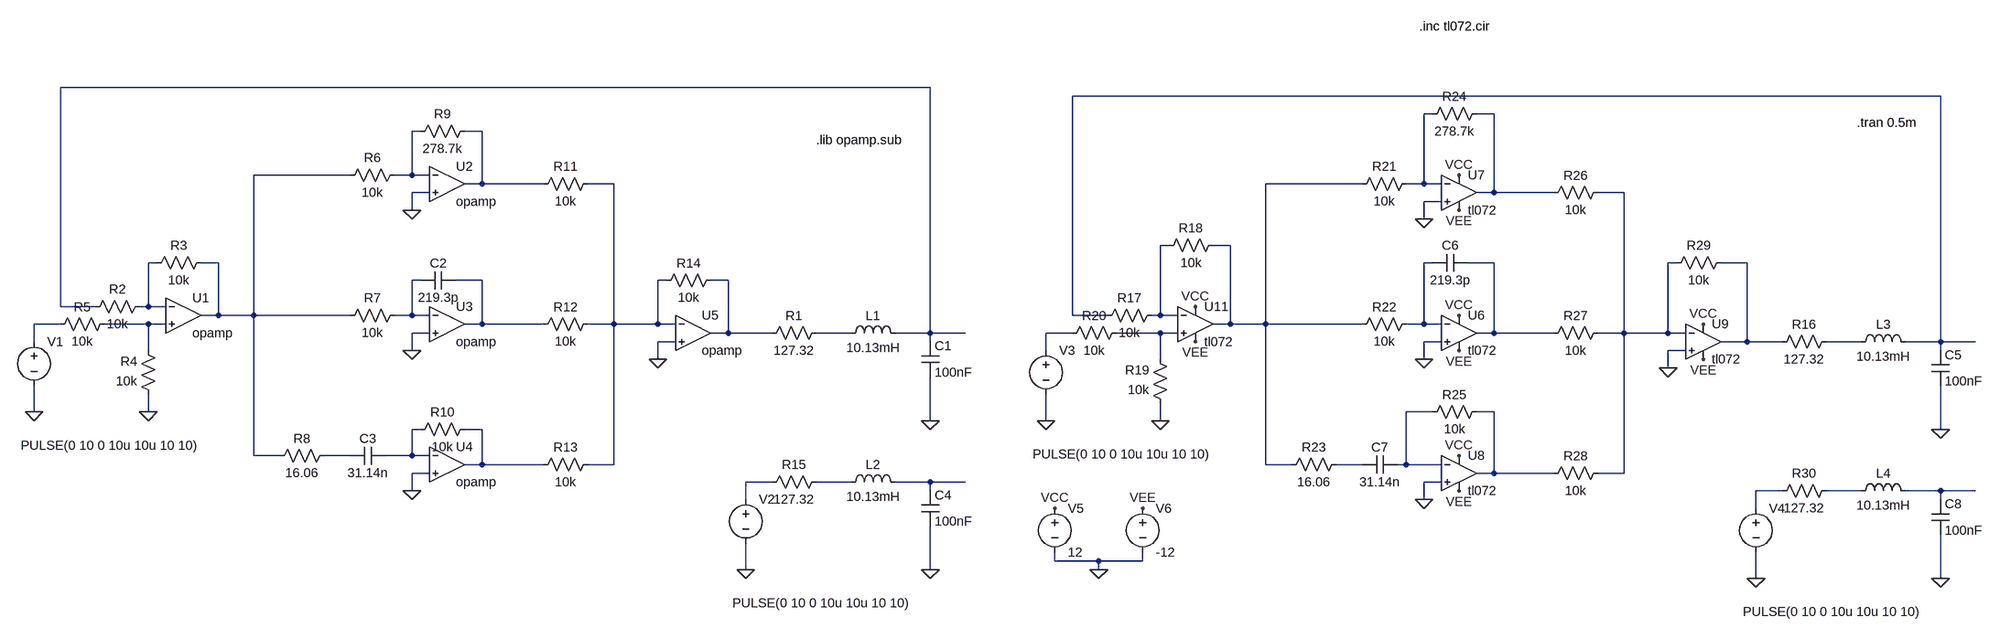
[diagram p0: schematic RLC.asc]
RLC.asc, the LTspice schematic file:
Version 4.1
SHEET 1 2324 700
WIRE 176 -336 -1408 -336
WIRE 2192 -320 608 -320
WIRE 1264 -288 1248 -288
WIRE 1376 -288 1344 -288
WIRE -752 -256 -768 -256
WIRE -640 -256 -672 -256
WIRE -880 -176 -1056 -176
WIRE -768 -176 -768 -256
WIRE -768 -176 -800 -176
WIRE -736 -176 -768 -176
WIRE -640 -160 -640 -256
WIRE -640 -160 -672 -160
WIRE -528 -160 -640 -160
WIRE -400 -160 -448 -160
WIRE 1136 -160 960 -160
WIRE 1248 -160 1248 -288
WIRE 1248 -160 1216 -160
WIRE 1280 -160 1248 -160
WIRE -736 -144 -768 -144
WIRE 1376 -144 1376 -288
WIRE 1376 -144 1344 -144
WIRE 1488 -144 1376 -144
WIRE 1616 -144 1568 -144
WIRE 1280 -128 1248 -128
WIRE -768 -112 -768 -144
WIRE 1248 -96 1248 -128
WIRE 784 -48 768 -48
WIRE 896 -48 864 -48
WIRE -1232 -16 -1248 -16
WIRE -1120 -16 -1152 -16
WIRE 1264 -16 1248 -16
WIRE 1376 -16 1328 -16
WIRE 1712 -16 1696 -16
WIRE 1840 -16 1792 -16
WIRE -752 16 -768 16
WIRE -640 16 -688 16
WIRE -304 16 -320 16
WIRE -192 16 -224 16
WIRE -1408 64 -1408 -336
WIRE -1344 64 -1408 64
WIRE -1248 64 -1248 -16
WIRE -1248 64 -1264 64
WIRE -1216 64 -1248 64
WIRE -1120 80 -1120 -16
WIRE -1120 80 -1152 80
WIRE -1056 80 -1056 -176
WIRE -1056 80 -1120 80
WIRE -880 80 -1056 80
WIRE -768 80 -768 16
WIRE -768 80 -800 80
WIRE -736 80 -768 80
WIRE 608 80 608 -320
WIRE 672 80 608 80
WIRE 768 80 768 -48
WIRE 768 80 752 80
WIRE 800 80 768 80
WIRE -1408 96 -1456 96
WIRE -1248 96 -1328 96
WIRE -1216 96 -1248 96
WIRE -640 96 -640 16
WIRE -640 96 -672 96
WIRE -528 96 -640 96
WIRE -400 96 -400 -160
WIRE -400 96 -448 96
WIRE -320 96 -320 16
WIRE -320 96 -400 96
WIRE -288 96 -320 96
WIRE 896 96 896 -48
WIRE 896 96 864 96
WIRE 960 96 960 -160
WIRE 960 96 896 96
WIRE 1136 96 960 96
WIRE 1248 96 1248 -16
WIRE 1248 96 1216 96
WIRE 1280 96 1248 96
WIRE -736 112 -768 112
WIRE -192 112 -192 16
WIRE -192 112 -224 112
WIRE -112 112 -192 112
WIRE 32 112 -32 112
WIRE 176 112 176 -336
WIRE 176 112 112 112
WIRE 240 112 176 112
WIRE 608 112 560 112
WIRE 768 112 688 112
WIRE 800 112 768 112
WIRE 1376 112 1376 -16
WIRE 1376 112 1344 112
WIRE 1488 112 1376 112
WIRE 1616 112 1616 -144
WIRE 1616 112 1568 112
WIRE 1696 112 1696 -16
WIRE 1696 112 1616 112
WIRE 1728 112 1696 112
WIRE -1456 128 -1456 96
WIRE -288 128 -320 128
WIRE 176 128 176 112
WIRE 1280 128 1248 128
WIRE 1840 128 1840 -16
WIRE 1840 128 1792 128
WIRE 1904 128 1840 128
WIRE 2048 128 1984 128
WIRE 2192 128 2192 -320
WIRE 2192 128 2128 128
WIRE 2256 128 2192 128
WIRE -1248 144 -1248 96
WIRE -768 144 -768 112
WIRE 560 144 560 112
WIRE 1728 144 1696 144
WIRE 2192 144 2192 128
WIRE -320 160 -320 128
WIRE 768 160 768 112
WIRE 1248 160 1248 128
WIRE 1696 176 1696 144
WIRE -1456 256 -1456 208
WIRE -1248 256 -1248 224
WIRE 1264 256 1216 256
WIRE 1376 256 1344 256
WIRE 176 272 176 192
WIRE 560 272 560 224
WIRE 768 272 768 240
WIRE -752 288 -768 288
WIRE -640 288 -672 288
WIRE 2192 288 2192 208
WIRE -1056 336 -1056 80
WIRE -1008 336 -1056 336
WIRE -880 336 -928 336
WIRE -768 336 -768 288
WIRE -768 336 -816 336
WIRE -736 336 -768 336
WIRE -640 352 -640 288
WIRE -640 352 -672 352
WIRE -528 352 -640 352
WIRE -400 352 -400 96
WIRE -400 352 -448 352
WIRE 960 352 960 96
WIRE 1008 352 960 352
WIRE 1136 352 1088 352
WIRE 1216 352 1216 256
WIRE 1216 352 1200 352
WIRE 1280 352 1216 352
WIRE -736 368 -768 368
WIRE 1376 368 1376 256
WIRE 1376 368 1344 368
WIRE 1488 368 1376 368
WIRE 1616 368 1616 112
WIRE 1616 368 1568 368
WIRE -112 384 -160 384
WIRE 32 384 -32 384
WIRE 176 384 112 384
WIRE 240 384 176 384
WIRE 1280 384 1248 384
WIRE -768 400 -768 368
WIRE 176 400 176 384
WIRE 1904 400 1856 400
WIRE 2048 400 1984 400
WIRE 2192 400 2128 400
WIRE 2256 400 2192 400
WIRE -160 416 -160 384
WIRE 1248 416 1248 384
WIRE 2192 416 2192 400
WIRE 1856 432 1856 400
WIRE 576 528 576 512
WIRE 656 528 576 528
WIRE 736 528 736 512
WIRE 736 528 656 528
WIRE -160 544 -160 496
WIRE 176 544 176 464
WIRE 656 544 656 528
WIRE 1856 560 1856 512
WIRE 2192 560 2192 480
FLAG -1248 256 0
FLAG 176 272 0
FLAG -768 -112 0
FLAG -768 400 0
FLAG -768 144 0
FLAG -320 160 0
FLAG -1456 256 0
FLAG 176 544 0
FLAG -160 544 0
FLAG 768 272 0
FLAG 2192 288 0
FLAG 1248 -96 0
FLAG 1248 416 0
FLAG 1248 160 0
FLAG 1696 176 0
FLAG 560 272 0
FLAG 2192 560 0
FLAG 1856 560 0
FLAG 832 64 VCC
FLAG 832 128 VEE
FLAG 1312 80 VCC
FLAG 1312 144 VEE
FLAG 1312 -176 VCC
FLAG 1312 -112 VEE
FLAG 1312 336 VCC
FLAG 1312 400 VEE
FLAG 1760 96 VCC
FLAG 1760 160 VEE
FLAG 656 544 0
FLAG 736 432 VEE
FLAG 576 432 VCC
SYMBOL res -16 96 R90
WINDOW 0 0 56 VBottom 2
WINDOW 3 32 56 VTop 2
SYMATTR InstName R1
SYMATTR Value 127.32
SYMBOL ind 16 128 R270
WINDOW 0 32 56 VTop 2
WINDOW 3 5 56 VBottom 2
SYMATTR InstName L1
SYMATTR Value 10.13mH
SYMATTR SpiceLine Rser=1m
SYMBOL cap 160 128 R0
SYMATTR InstName C1
SYMATTR Value 100nF
SYMBOL OpAmps\\opamp -1184 16 R0
SYMATTR InstName U1
SYMATTR SpiceLine2 GBW=1000Meg
SYMBOL OpAmps\\opamp -704 -224 R0
SYMATTR InstName U2
SYMATTR SpiceLine2 GBW=1000Meg
SYMBOL OpAmps\\opamp -704 32 R0
SYMATTR InstName U3
SYMATTR SpiceLine2 GBW=1000Meg
SYMBOL OpAmps\\opamp -704 288 R0
SYMATTR InstName U4
SYMATTR SpiceLine2 GBW=1000Meg
SYMBOL OpAmps\\opamp -256 48 R0
SYMATTR InstName U5
SYMATTR SpiceLine2 GBW=1000Meg
SYMBOL res -1248 48 R90
WINDOW 0 0 56 VBottom 2
WINDOW 3 32 56 VTop 2
SYMATTR InstName R2
SYMATTR Value 10k
SYMBOL res -1136 -32 R90
WINDOW 0 0 56 VBottom 2
WINDOW 3 32 56 VTop 2
SYMATTR InstName R3
SYMATTR Value 10k
SYMBOL res -1232 240 R180
WINDOW 0 36 76 Left 2
WINDOW 3 36 40 Left 2
SYMATTR InstName R4
SYMATTR Value 10k
SYMBOL res -1424 112 R270
WINDOW 0 32 56 VTop 2
WINDOW 3 0 56 VBottom 2
SYMATTR InstName R5
SYMATTR Value 10k
SYMBOL res -784 -192 R90
WINDOW 0 0 56 VBottom 2
WINDOW 3 32 56 VTop 2
SYMATTR InstName R6
SYMATTR Value 10k
SYMBOL res -784 64 R90
WINDOW 0 0 56 VBottom 2
WINDOW 3 32 56 VTop 2
SYMATTR InstName R7
SYMATTR Value 10k
SYMBOL res -912 320 R90
WINDOW 0 0 56 VBottom 2
WINDOW 3 32 56 VTop 2
SYMATTR InstName R8
SYMATTR Value 16.06
SYMBOL res -656 -272 R90
WINDOW 0 0 56 VBottom 2
WINDOW 3 32 56 VTop 2
SYMATTR InstName R9
SYMATTR Value 278.7k
SYMBOL cap -688 0 R90
WINDOW 0 0 32 VBottom 2
WINDOW 3 32 32 VTop 2
SYMATTR InstName C2
SYMATTR Value 219.3p
SYMBOL res -656 272 R90
WINDOW 0 0 56 VBottom 2
WINDOW 3 32 56 VTop 2
SYMATTR InstName R10
SYMATTR Value 10k
SYMBOL cap -816 320 R90
WINDOW 0 0 32 VBottom 2
WINDOW 3 32 32 VTop 2
SYMATTR InstName C3
SYMATTR Value 31.14n
SYMBOL res -432 -176 R90
WINDOW 0 0 56 VBottom 2
WINDOW 3 32 56 VTop 2
SYMATTR InstName R11
SYMATTR Value 10k
SYMBOL res -432 80 R90
WINDOW 0 0 56 VBottom 2
WINDOW 3 32 56 VTop 2
SYMATTR InstName R12
SYMATTR Value 10k
SYMBOL res -432 336 R90
WINDOW 0 0 56 VBottom 2
WINDOW 3 32 56 VTop 2
SYMATTR InstName R13
SYMATTR Value 10k
SYMBOL res -208 0 R90
WINDOW 0 0 56 VBottom 2
WINDOW 3 32 56 VTop 2
SYMATTR InstName R14
SYMATTR Value 10k
SYMBOL voltage -1456 112 R0
WINDOW 3 -24 205 Left 2
WINDOW 123 0 0 Left 0
WINDOW 39 0 0 Left 0
SYMATTR Value PULSE(0 10 0 10u 10u 10 10)
SYMATTR InstName V1
SYMBOL res -16 368 R90
WINDOW 0 0 56 VBottom 2
WINDOW 3 32 56 VTop 2
SYMATTR InstName R15
SYMATTR Value 127.32
SYMBOL ind 16 400 R270
WINDOW 0 32 56 VTop 2
WINDOW 3 5 56 VBottom 2
SYMATTR InstName L2
SYMATTR Value 10.13mH
SYMATTR SpiceLine Rser=1m
SYMBOL cap 160 400 R0
SYMATTR InstName C4
SYMATTR Value 100nF
SYMBOL voltage -160 400 R0
WINDOW 3 -24 205 Left 2
WINDOW 123 0 0 Left 0
WINDOW 39 0 0 Left 0
SYMATTR Value PULSE(0 10 0 10u 10u 10 10)
SYMATTR InstName V2
SYMBOL res 2000 112 R90
WINDOW 0 0 56 VBottom 2
WINDOW 3 32 56 VTop 2
SYMATTR InstName R16
SYMATTR Value 127.32
SYMBOL ind 2032 144 R270
WINDOW 0 32 56 VTop 2
WINDOW 3 5 56 VBottom 2
SYMATTR InstName L3
SYMATTR Value 10.13mH
SYMATTR SpiceLine Rser=1m
SYMBOL cap 2176 144 R0
SYMATTR InstName C5
SYMATTR Value 100nF
SYMBOL res 768 64 R90
WINDOW 0 0 56 VBottom 2
WINDOW 3 32 56 VTop 2
SYMATTR InstName R17
SYMATTR Value 10k
SYMBOL res 880 -64 R90
WINDOW 0 0 56 VBottom 2
WINDOW 3 32 56 VTop 2
SYMATTR InstName R18
SYMATTR Value 10k
SYMBOL res 784 256 R180
WINDOW 0 36 76 Left 2
WINDOW 3 36 40 Left 2
SYMATTR InstName R19
SYMATTR Value 10k
SYMBOL res 592 128 R270
WINDOW 0 32 56 VTop 2
WINDOW 3 0 56 VBottom 2
SYMATTR InstName R20
SYMATTR Value 10k
SYMBOL res 1232 -176 R90
WINDOW 0 0 56 VBottom 2
WINDOW 3 32 56 VTop 2
SYMATTR InstName R21
SYMATTR Value 10k
SYMBOL res 1232 80 R90
WINDOW 0 0 56 VBottom 2
WINDOW 3 32 56 VTop 2
SYMATTR InstName R22
SYMATTR Value 10k
SYMBOL res 1104 336 R90
WINDOW 0 0 56 VBottom 2
WINDOW 3 32 56 VTop 2
SYMATTR InstName R23
SYMATTR Value 16.06
SYMBOL res 1360 -304 R90
WINDOW 0 0 56 VBottom 2
WINDOW 3 32 56 VTop 2
SYMATTR InstName R24
SYMATTR Value 278.7k
SYMBOL cap 1328 -32 R90
WINDOW 0 0 32 VBottom 2
WINDOW 3 32 32 VTop 2
SYMATTR InstName C6
SYMATTR Value 219.3p
SYMBOL res 1360 240 R90
WINDOW 0 0 56 VBottom 2
WINDOW 3 32 56 VTop 2
SYMATTR InstName R25
SYMATTR Value 10k
SYMBOL cap 1200 336 R90
WINDOW 0 0 32 VBottom 2
WINDOW 3 32 32 VTop 2
SYMATTR InstName C7
SYMATTR Value 31.14n
SYMBOL res 1584 -160 R90
WINDOW 0 0 56 VBottom 2
WINDOW 3 32 56 VTop 2
SYMATTR InstName R26
SYMATTR Value 10k
SYMBOL res 1584 96 R90
WINDOW 0 0 56 VBottom 2
WINDOW 3 32 56 VTop 2
SYMATTR InstName R27
SYMATTR Value 10k
SYMBOL res 1584 352 R90
WINDOW 0 0 56 VBottom 2
WINDOW 3 32 56 VTop 2
SYMATTR InstName R28
SYMATTR Value 10k
SYMBOL res 1808 -32 R90
WINDOW 0 0 56 VBottom 2
WINDOW 3 32 56 VTop 2
SYMATTR InstName R29
SYMATTR Value 10k
SYMBOL voltage 560 128 R0
WINDOW 3 -24 205 Left 2
WINDOW 123 0 0 Left 0
WINDOW 39 0 0 Left 0
SYMATTR Value PULSE(0 10 0 10u 10u 10 10)
SYMATTR InstName V3
SYMBOL res 2000 384 R90
WINDOW 0 0 56 VBottom 2
WINDOW 3 32 56 VTop 2
SYMATTR InstName R30
SYMATTR Value 127.32
SYMBOL ind 2032 416 R270
WINDOW 0 32 56 VTop 2
WINDOW 3 5 56 VBottom 2
SYMATTR InstName L4
SYMATTR Value 10.13mH
SYMATTR SpiceLine Rser=1m
SYMBOL cap 2176 416 R0
SYMATTR InstName C8
SYMATTR Value 100nF
SYMBOL voltage 1856 416 R0
WINDOW 3 -24 205 Left 2
WINDOW 123 0 0 Left 0
WINDOW 39 0 0 Left 0
SYMATTR Value PULSE(0 10 0 10u 10u 10 10)
SYMATTR InstName V4
SYMBOL OpAmps\\opamp2 832 32 R0
SYMATTR InstName U11
SYMATTR Value tl072
SYMBOL OpAmps\\opamp2 1312 48 R0
SYMATTR InstName U6
SYMATTR Value tl072
SYMBOL OpAmps\\opamp2 1312 -208 R0
SYMATTR InstName U7
SYMATTR Value tl072
SYMBOL OpAmps\\opamp2 1312 304 R0
SYMATTR InstName U8
SYMATTR Value tl072
SYMBOL OpAmps\\opamp2 1760 64 R0
SYMATTR InstName U9
SYMATTR Value tl072
SYMBOL voltage 576 416 R0
WINDOW 123 0 0 Left 0
WINDOW 39 0 0 Left 0
SYMATTR InstName V5
SYMATTR Value 12
SYMBOL voltage 736 416 R0
WINDOW 123 0 0 Left 0
WINDOW 39 0 0 Left 0
SYMATTR InstName V6
SYMATTR Value -12
TEXT -32 -240 Left 2 !.lib opamp.sub
TEXT 2040 -272 Left 2 !.tran 0.5m
TEXT 1240 -448 Left 2 !.inc tl072.cir

The netlist it stands for:
* RLC.asc
R1 N021 N018 127.32
L1 N021 N001 10.13mH Rser=1m
C1 N001 0 100nF
X§U1 N012 N020 N007 opamp Aol=100K GBW=1000Meg  ; pins invin noninvin out
X§U2 N005 0 N006 opamp Aol=100K GBW=1000Meg  ; pins invin noninvin out
X§U3 N016 0 N017 opamp Aol=100K GBW=1000Meg  ; pins invin noninvin out
X§U4 N027 0 N028 opamp Aol=100K GBW=1000Meg  ; pins invin noninvin out
X§U5 N008 0 N018 opamp Aol=100K GBW=1000Meg  ; pins invin noninvin out
R2 N012 N001 10k
R3 N007 N012 10k
R4 0 N020 10k
R5 N019 N020 10k
R6 N005 N007 10k
R7 N016 N007 10k
R8 N029 N007 16.06
R9 N006 N005 278.7k
C2 N017 N016 219.3p
R10 N028 N027 10k
C3 N027 N029 31.14n
R11 N008 N006 10k
R12 N008 N017 10k
R13 N008 N028 10k
R14 N018 N008 10k
V1 N019 0 PULSE(0 10 0 10u 10u 10 10)
R15 N032 N031 127.32
L2 N032 N033 10.13mH Rser=1m
C4 N033 0 100nF
V2 N031 0 PULSE(0 10 0 10u 10u 10 10)
R16 N024 N015 127.32
L3 N024 N002 10.13mH Rser=1m
C5 N002 0 100nF
R17 N011 N002 10k
R18 N009 N011 10k
R19 0 N023 10k
R20 N022 N023 10k
R21 N003 N009 10k
R22 N013 N009 10k
R23 N030 N009 16.06
R24 N004 N003 278.7k
C6 N014 N013 219.3p
R25 N026 N025 10k
C7 N025 N030 31.14n
R26 N010 N004 10k
R27 N010 N014 10k
R28 N010 N026 10k
R29 N015 N010 10k
V3 N022 0 PULSE(0 10 0 10u 10u 10 10)
R30 N035 N034 127.32
L4 N035 N036 10.13mH Rser=1m
C8 N036 0 100nF
V4 N034 0 PULSE(0 10 0 10u 10u 10 10)
X§U11 N023 N011 VCC VEE N009 tl072  ; pins In+ In- V+ V- OUT
X§U6 0 N013 VCC VEE N014 tl072  ; pins In+ In- V+ V- OUT
X§U7 0 N003 VCC VEE N004 tl072  ; pins In+ In- V+ V- OUT
X§U8 0 N025 VCC VEE N026 tl072  ; pins In+ In- V+ V- OUT
X§U9 0 N010 VCC VEE N015 tl072  ; pins In+ In- V+ V- OUT
V5 VCC 0 12
V6 VEE 0 -12
.lib opamp.sub
.tran 0.5m
.inc tl072.cir
.backanno
.end